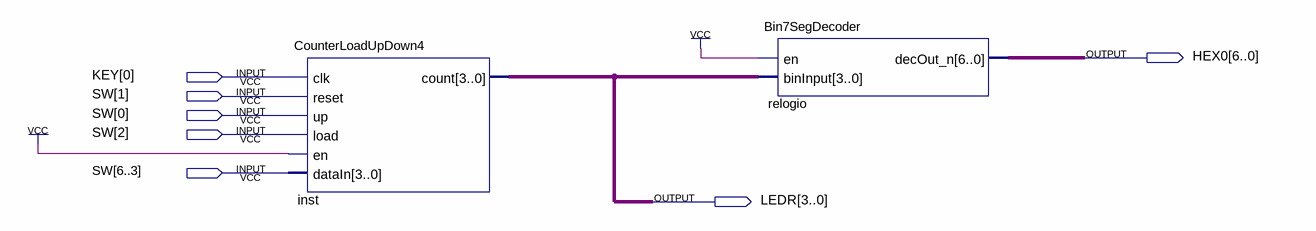
[diagram p0: schematic sheet]
// Quartus schematic Counter_Demo2.bdf as structural Verilog: 2 symbols, 7 pins
module Counter_Demo2 (
  input  [0:0] KEY,
  input  [6:0] SW,
  output [6:0] HEX0,
  output [3:0] LEDR
);

  CounterLoadUpDown4 inst (
    .clk(KEY[0]), .reset(SW[1]), .up(SW[0]), .load(SW[2]), .en(1'b1), .dataIn(SW[6:3]), .count(LEDR));
  Bin7SegDecoder relogio (.en(1'b1), .binInput(LEDR), .decOut_n(HEX0));
endmodule
